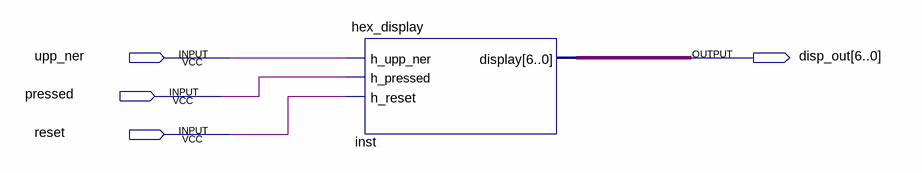
[diagram p0: schematic sheet]
// Quartus schematic Block1.bdf as structural Verilog: 1 symbols, 4 pins
module Block1 (
  input  upp_ner,
  input  pressed,
  input  reset,
  output [6:0] disp_out
);

  hex_display inst (.h_upp_ner(upp_ner), .h_pressed(pressed), .h_reset(reset), .display(disp_out));
endmodule
